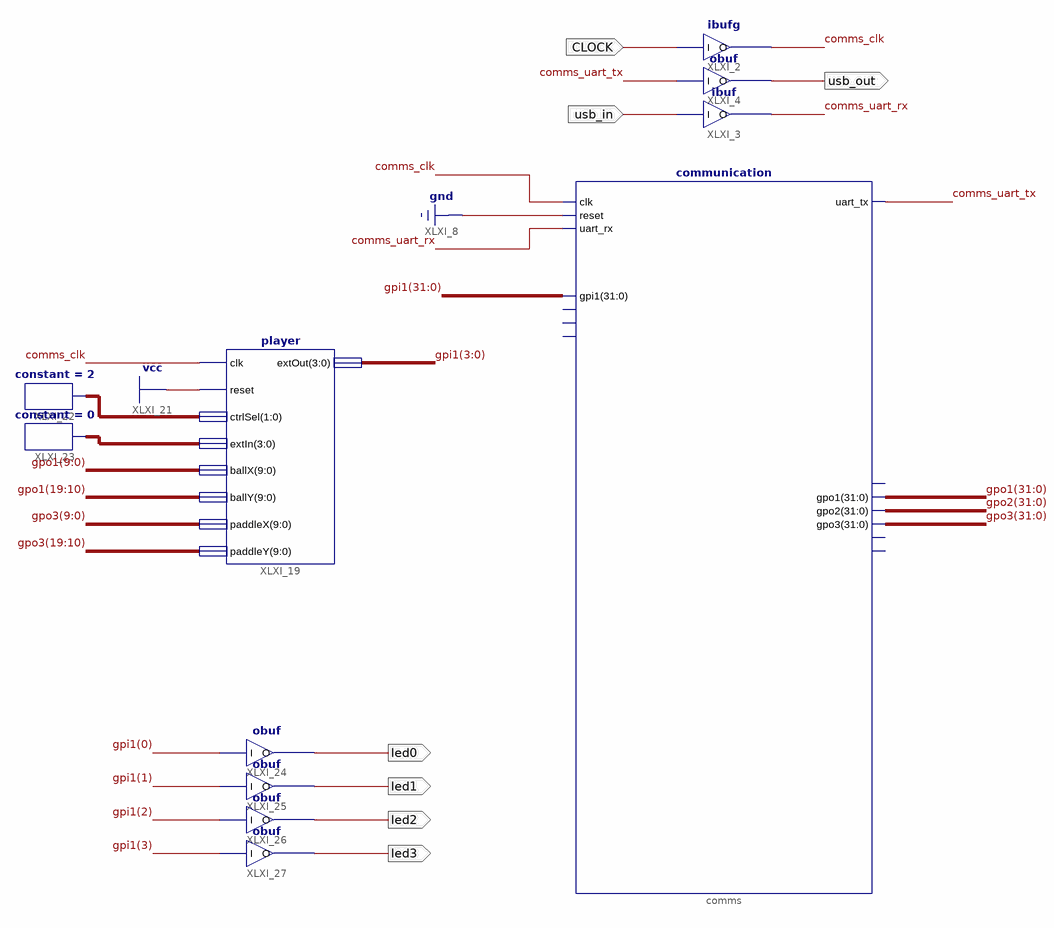
[diagram p0: schematic sheet 1]
// Xilinx ISE schematic pong.sch (artix7) as structural Verilog: 11 symbols, 7 ports
module pong (
  input  CLOCK,
  input  usb_in,
  output usb_out,
  output led0,
  output led1,
  output led2,
  output led3
);

  wire comms_clk, comms_uart_rx, comms_uart_tx;
  wire [1:0] XLXN_41;
  wire [3:0] XLXN_42;
  wire [31:0] gpi1, gpo1, gpo2, gpo3;

  ibufg XLXI_2 (.I(CLOCK), .O(comms_clk));
  ibuf XLXI_3 (.I(usb_in), .O(comms_uart_rx));
  obuf XLXI_4 (.I(comms_uart_tx), .O(usb_out));
  player XLXI_19 (
    .clk(comms_clk), .reset(1'b1), .ctrlSel(XLXN_41), .extIn(XLXN_42), .ballX(gpo1[9:0]),
    .ballY(gpo1[19:10]), .paddleX(gpo3[9:0]), .paddleY(gpo3[19:10]), .extOut(gpi1[3:0]));
  constant #(.CValue("2")) XLXI_22 (.O(XLXN_41));
  constant #(.CValue("0")) XLXI_23 (.O(XLXN_42));
  obuf XLXI_24 (.I(gpi1[0]), .O(led0));
  obuf XLXI_25 (.I(gpi1[1]), .O(led1));
  obuf XLXI_26 (.I(gpi1[2]), .O(led2));
  obuf XLXI_27 (.I(gpi1[3]), .O(led3));
  communication comms (
    .clk(comms_clk), .reset(1'b0), .uart_tx(comms_uart_tx), .uart_rx(comms_uart_rx), .gpi1(gpi1),
    .gpo1(gpo1), .gpo2(gpo2), .gpo3(gpo3));  // open: uart_interrupt, gpi2, gpi3, gpi4, gpo4, intc_irq
endmodule
